# Altium schematic sheet 06_CANBUS.SchDoc: =TitleParameter
size A3; Organization: ASISGUARD; Address1: Kemalpasa, Kemalpasa Cd. No:290 D:292H, 35060 Bornova/Izmir/Turkey; SheetNumber: 6; SheetTotal: 8
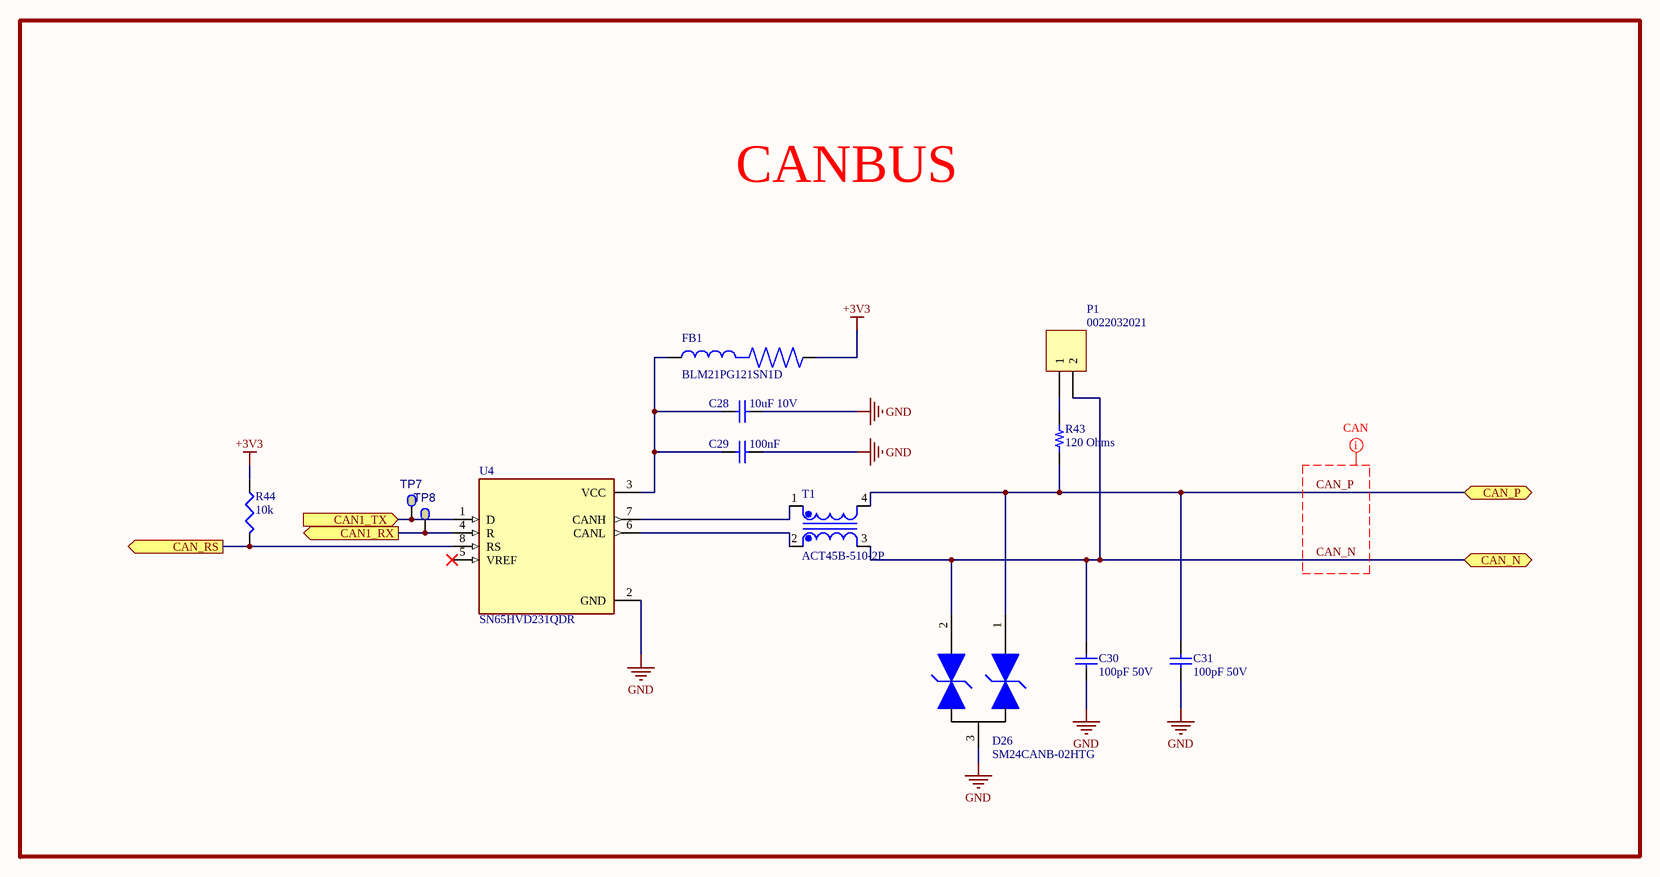
[diagram p0: 06_CANBUS.SchDoc]

## Parts
C28  value 10uF 10V  [SMC0603]  (hidden comment: CAP CER 10UF 10V X5R 0603)
C29  100nF  [CAP0603]
C30  value 100pF 50V  [CAP0603]  (hidden comment: CAP CER 100PF 50V C0G/NP0 0603)
C31  value 100pF 50V  [CAP0603]  (hidden comment: CAP CER 100PF 50V C0G/NP0 0603)
D26  Manufacturer Part Number: SM24CANB-02HTG  [SOT23_3-DIODE]  (hidden comment: CAN)
FB1  BLM21PG121SN1D  [BEADC2012X105N/]
P1  0022032021  [THD 1x2p. male straight]
R43  120 Ohms  [RES 1206_3216]
R44  value 10k  [RES0603]  (hidden comment: RES 10K OHM 1% 1/8W 0603)
T1  ACT45B-510-2P  [TDK_ACT45B-510-2P-TL003_0]
TP7  Testpoint  [SMD_Ø1.5mm]  (value not drawn)  (no BOM)
TP8  Testpoint  [SMD_Ø1.5mm]  (value not drawn)  (no BOM)
U4  SN65HVD231QDR  [SOIC127P599X175-8N/]

## Blocks framed on the sheet
CANBUS: C28-C31 D26 FB1 P1 R43 R44 T1 TP7 TP8 U4

## Ports
CAN1_RX (out), CAN1_TX (in), CAN_N (bidir), CAN_P (bidir), CAN_RS (out)

## Nets
+3V3: FB1.2 R44.1
GND: C28.1 C29.1 C30.1 C31.1 D26.3 U4.2(GND)
CAN1_RX: TP8.1(P1) U4.4(R) ; port CAN1_RX
CAN1_TX: TP7.1(P1) U4.1(D) ; port CAN1_TX
CAN_N: C30.2 D26.2 P1.2 T1.3 ; port CAN_N
CAN_P: C31.2 D26.1 R43.1 T1.4 ; port CAN_P
CAN_RS: R44.2 U4.8(RS) ; port CAN_RS
NetC28_2: C28.2 C29.2 FB1.1 U4.3(VCC)
NetP1_1: P1.1 R43.2
NetT1_1: T1.1 U4.7(CANH)
NetT1_2: T1.2 U4.6(CANL)

Not connected (* = marked no-connect by the designer): U4 5(VREF)*

## Layout directives
net class CAN: CAN_N, CAN_P

## Notes on the sheet
- Proje/Project:
- Sayfa Adı/Document Name:
- Çizilme Tarihi/Drawing Date
- Umit KAYACIK
- Tasarlayan/Designed By
- Sayfa/Sheet:
- Revision:
- of
- Son Güncelleme/Last Edit Date
- Kontrol eden/Checked By
- Onaylayan/Approved By
- Boyut/Size:
- Varyant/Variant:
- Dil/Language:
- A3
- ENG

## Library data of the parts
C28 = CAP0603_10UF_10V: 10 µF ±10% 10V Ceramic Capacitor X5R 0603 (1608 Metric); Manufacturer Part Number: CL10A106KP8NNNC; Order Code: DIGI: 1276-1192-2-ND; Sirius Stock Code: *; LCSC Part Number: C19702; LCSC Manufacturer Part Number: CL10A106KP8NNNC
C29 = CAP0603_100nF_50V: 0.1 µF ±10% 50V Ceramic Capacitor X7R 0603 (1608 Metric); Manufacturer Name: KEMET; Manufacturer Part Number: C0603C104K5RAC7867; Datasheet Link: https://componentsearchengine.com/Datasheets/1/06031A100FAT2A.pdf; Height: 0.9mm
C30 C31 = CAP0603_100PF: 100 pF ±5% 50V Ceramic Capacitor C0G, NP0 0603 (1608 Metric); Manufacturer Part Number: CL10C101JB8NNNC; LCSC Part Number: C14858
D26 = SM24CANB-02HTG_TVS: TVS DIODE 24VWM 50VC SOT23-3; Order Code: DIGI : F6707CT-ND; Value: 2Ch; LCSC Manufacturer Part Number: SM24CANB-02HTG; LCSC Part Number: C151237
FB1 = BLM21PG121SN1D: 120 Ohms @ 100 MHz 1 Power Line Ferrite Bead 0805 (2012 Metric) 3A 30mOhm; MPN: BLM21PG121SN1D; Supplier: Digi; 490-5986-6-ND
P1 = Header 2: CONN HEADER VERT 2POS 2.54MM; Manufacturer: Molex; Manufacturer Part Number: 0022032021; Supplier Part Number: WM4000-ND
R43 = AC1206FR-07120RL: RES SMD 120 OHM 1% 1/4W 1206; Manufacturer: Yageo; Power (Watts): 0.25W, 1/4W; Temperature Coefficient: ±100ppm/°C; Part Number: AC1206FR-07120RL; ComponentLink1Description: Datasheet; ComponentLink1URL: https://www.yageo.com/upload/media/product/productsearch/datasheet/rchip/PYu-AC_51_RoHS_L_7.pdf; ComponentLink2Description: DigiKey Link; ComponentLink2URL: https://www.digikey.com/en/products/detail/yageo/AC1206FR-07120RL/5897228; Composition: Thick Film; Device Package: 1206 (3216 Metric); Features: Automotive AEC-Q200, Moisture Resistant; Height - Seated (Max): 0.026" (0.65mm); LastUpdated: 2/9/2024 8:54:27 PM; Lifecycle Status: Active; Minimum Order: 1; Number of Terminations: 2; Operating Temperature: -55°C ~ 155°C; Package / Case: 1206 (3216 Metric); Packaging: TapeAndReel; PartId: 31141; Part Status: Active; Price: 0.01; Ratings: AEC-Q200; Resistance: 120 Ohms; Series: AC; Size / Dimension: 0.122" L x 0.063" W (3.10mm x 1.60mm); Supplier 1: DigiKey; Supplier Part Number 1: YAG3810CT-ND; Supplier Device Package: 1206; Tolerance: ±1%; Value: 120 Ohms
R44 = RES0603_10K_%1_1: 10 kOhms ±1% 0.125W, 1/8W Chip Resistor 0603 (1608 Metric) Anti-Sulfur Thin Film; Manufacturer Part Number: RNCP0603FTD10K0; LCSC Manufacturer Part Number: MCT06030C1002FP500; Order Code: Digi: RNCP0603FTD10K0TR-ND; Sirius Stock Code: *; LCSC Part Number: C161803
T1 = ACT45B-510-2P: Ind Common Mode Filter Wirewound 51uH 2KOhm -30% to 50% 100KHz 200mA 1812 T/R; Manufacturer: TDK; Manufacturer Part Number: ACT45B-510-2P-TL003; Core Material: Ferrite; Impedance: 2.8kR; DC Resistance (DCR): 1R; Number of Lines: 2; Voltage Rating (DC): 50V; Test Frequency: 10MHz; Insulation Resistance: 10MR; Element Configuration: Dual; Supplier 1: Digi-Key; Supplier Part Number 1: 445-3958-1-ND; RoHS: Yes; Category: Fixed Inductors; Stock 1: 75821; Pricing 1: 1=1,95000, 10=1,80000, 25=1,65000, 50=1,41000, 100=1,26000, 250=1,08000, 500=1,02000, 1000=0,93000 (USD); Mount: Surface Mount; Case/Package: 1812; Number of Pins: 4; Case Code (Imperial): 1812; Min Operating Temperature: -40°C; Max Operating Temperature: 150°C; Inductance: 51uH; Packaging: Tape and Reel; Package Quantity: 2000; Tolerance: 50%; Current Rating: 200mA; Max DC Current: 200mA; Current: 200mA; Voltage Rating: 50V; Termination: SMD/SMT; DC Current: 200mA; Self Resonant Frequency: 10MHz; Length: 4.7mm; Width: 3.2mm; Height: 2.8mm; Depth: 3.4mm; Radiation Hardening: No; REACH SVHC: No SVHC; Lead Free: Lead Free; Military Standard: Not; ComponentLink1URL: https://datasheet.ciiva.com/22726/1649098-22726290.pdf?src-supplier=Element14; ComponentLink1Description: https://datasheet.ciiva.com/22726/1649098-22726290.pdf?src-supplier=Element14; ComponentLink2URL: https://datasheet.ciiva.com/26793/act45b-510-2p-tl003-26793344.pdf?src-supplier=IIIC; ComponentLink2Description: https://datasheet.ciiva.com/26793/act45b-510-2p-tl003-26793344.pdf?src-supplier=IIIC; ComponentLink3URL: https://datasheet.ciiva.com/8498/e9711-act-8498633.pdf?src-supplier=Avnet; ComponentLink3Description: https://datasheet.ciiva.com/8498/e9711-act-8498633.pdf?src-supplier=Avnet; ComponentLink4URL: https://datasheet.ciiva.com/1007/e9711-act-1007931.pdf?src-supplier=Digi-Key; ComponentLink4Description: https://datasheet.ciiva.com/1007/e9711-act-1007931.pdf?src-supplier=Digi-Key; ComponentLink5URL: https://datasheet.ciiva.com/15191/getdatasheetpartid-349822-15191803.pdf?src-supplier=Verical; ComponentLink5Description: https://datasheet.ciiva.com/15191/getdatasheetpartid-349822-15191803.pdf?src-supplier=Verical; ComponentLink6URL: https://datasheet.ciiva.com/1007/e9711-act-1007932.pdf?src-supplier=Digi-Key; ComponentLink6Description: https://datasheet.ciiva.com/1007/e9711-act-1007932.pdf?src-supplier=Digi-Key; ComponentLink7URL: https://datasheet.ciiva.com/1007/e9711-act-1007933.pdf?src-supplier=Digi-Key; ComponentLink7Description: https://datasheet.ciiva.com/1007/e9711-act-1007933.pdf?src-supplier=Digi-Key; ComponentLink8URL: https://datasheet.ciiva.com/7649/1833202-7649183.pdf?src-supplier=Element14; ComponentLink8Description: https://datasheet.ciiva.com/7649/1833202-7649183.pdf?src-supplier=Element14; LCSC Manufacturer Part Number: ACT45B-510-2P-TL003; LCSC Part Number: C76584
TP7 TP8 = TEST PAD SMT 10MIL X 20MIL: DNP: DNP; Value: Testpoint
U4 = SN65HVD231QDR: 3.3-V CAN Transceiver with Sleep Mode; MPN: SN65HVD231QDR; Supplier: Digi; 296-48950-6-ND